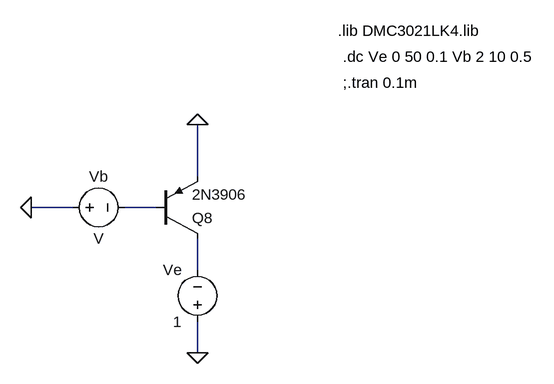
[diagram p0: schematic Test_Q3_Q4_Q5_Q7_Q8.asc]
Test_Q3_Q4_Q5_Q7_Q8.asc, the LTspice schematic file:
Version 4
SHEET 1 1288 936
WIRE 128 640 128 560
WIRE -64 688 -128 688
WIRE 64 688 16 688
WIRE 128 784 128 736
WIRE 128 912 128 864
FLAG -128 688 0
FLAG 128 912 0
FLAG 128 560 0
SYMBOL pnp 64 736 M180
SYMATTR InstName Q8
SYMATTR Value 2N3906
SYMBOL Voltage 128 880 R180
WINDOW 0 24 96 Left 2
WINDOW 3 24 16 Left 2
SYMATTR InstName Ve
SYMATTR Value 1
SYMBOL Voltage -80 688 R270
WINDOW 0 32 56 VTop 2
WINDOW 3 -32 56 VBottom 2
SYMATTR InstName Vb
TEXT 344 416 Left 2 !.lib DMC3021LK4.lib
TEXT 352 456 Left 2 !.dc Ve 0 50 0.1 Vb 2 10 0.5
TEXT 352 496 Left 2 !;.tran 0.1m

The netlist it stands for:
* Test_Q3_Q4_Q5_Q7_Q8.asc
Q8 N002 N001 0 0 2N3906
Ve 0 N002 1
Vb 0 N001 V
.model NPN NPN
.model PNP PNP
.lib standard.bjt
.lib DMC3021LK4.lib
.dc Ve 0 50 0.1 Vb 2 10 0.5
;.tran 0.1m
.backanno
.end